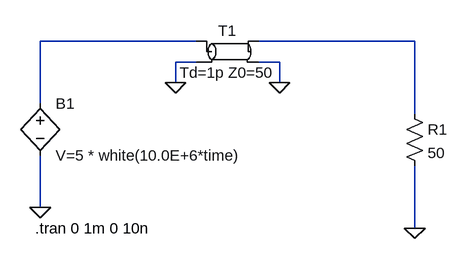
[diagram p0: schematic 1 1.asc]
1 1.asc, the LTspice schematic file:
Version 4
SHEET 1 880 680
WIRE 320 32 80 32
WIRE 656 32 416 32
WIRE 320 64 288 64
WIRE 448 64 416 64
WIRE 288 96 288 64
WIRE 448 96 448 64
WIRE 80 128 80 32
WIRE 656 144 656 32
WIRE 80 288 80 208
WIRE 656 320 656 224
FLAG 80 288 0
FLAG 656 320 0
FLAG 288 96 0
FLAG 448 96 0
SYMBOL bv 80 112 R0
SYMATTR InstName B1
SYMATTR Value V=5 * white(10.0E+6*time)
SYMBOL res 640 128 R0
SYMATTR InstName R1
SYMATTR Value 50
SYMBOL tline 368 48 R0
SYMATTR InstName T1
SYMATTR Value Td=1p Z0=50
TEXT 72 320 Left 2 !.tran 0 1m 0 10n

The netlist it stands for:
* 1 1.asc
B1 N001 0 V=5 * white(10.0E+6*time)
R1 N002 0 50
T1 N001 0 N002 0 Td=1p Z0=50
.tran 0 1m 0 10n
.backanno
.end